# EAGLE design BT_3860 (EAGLE 6.5.0)
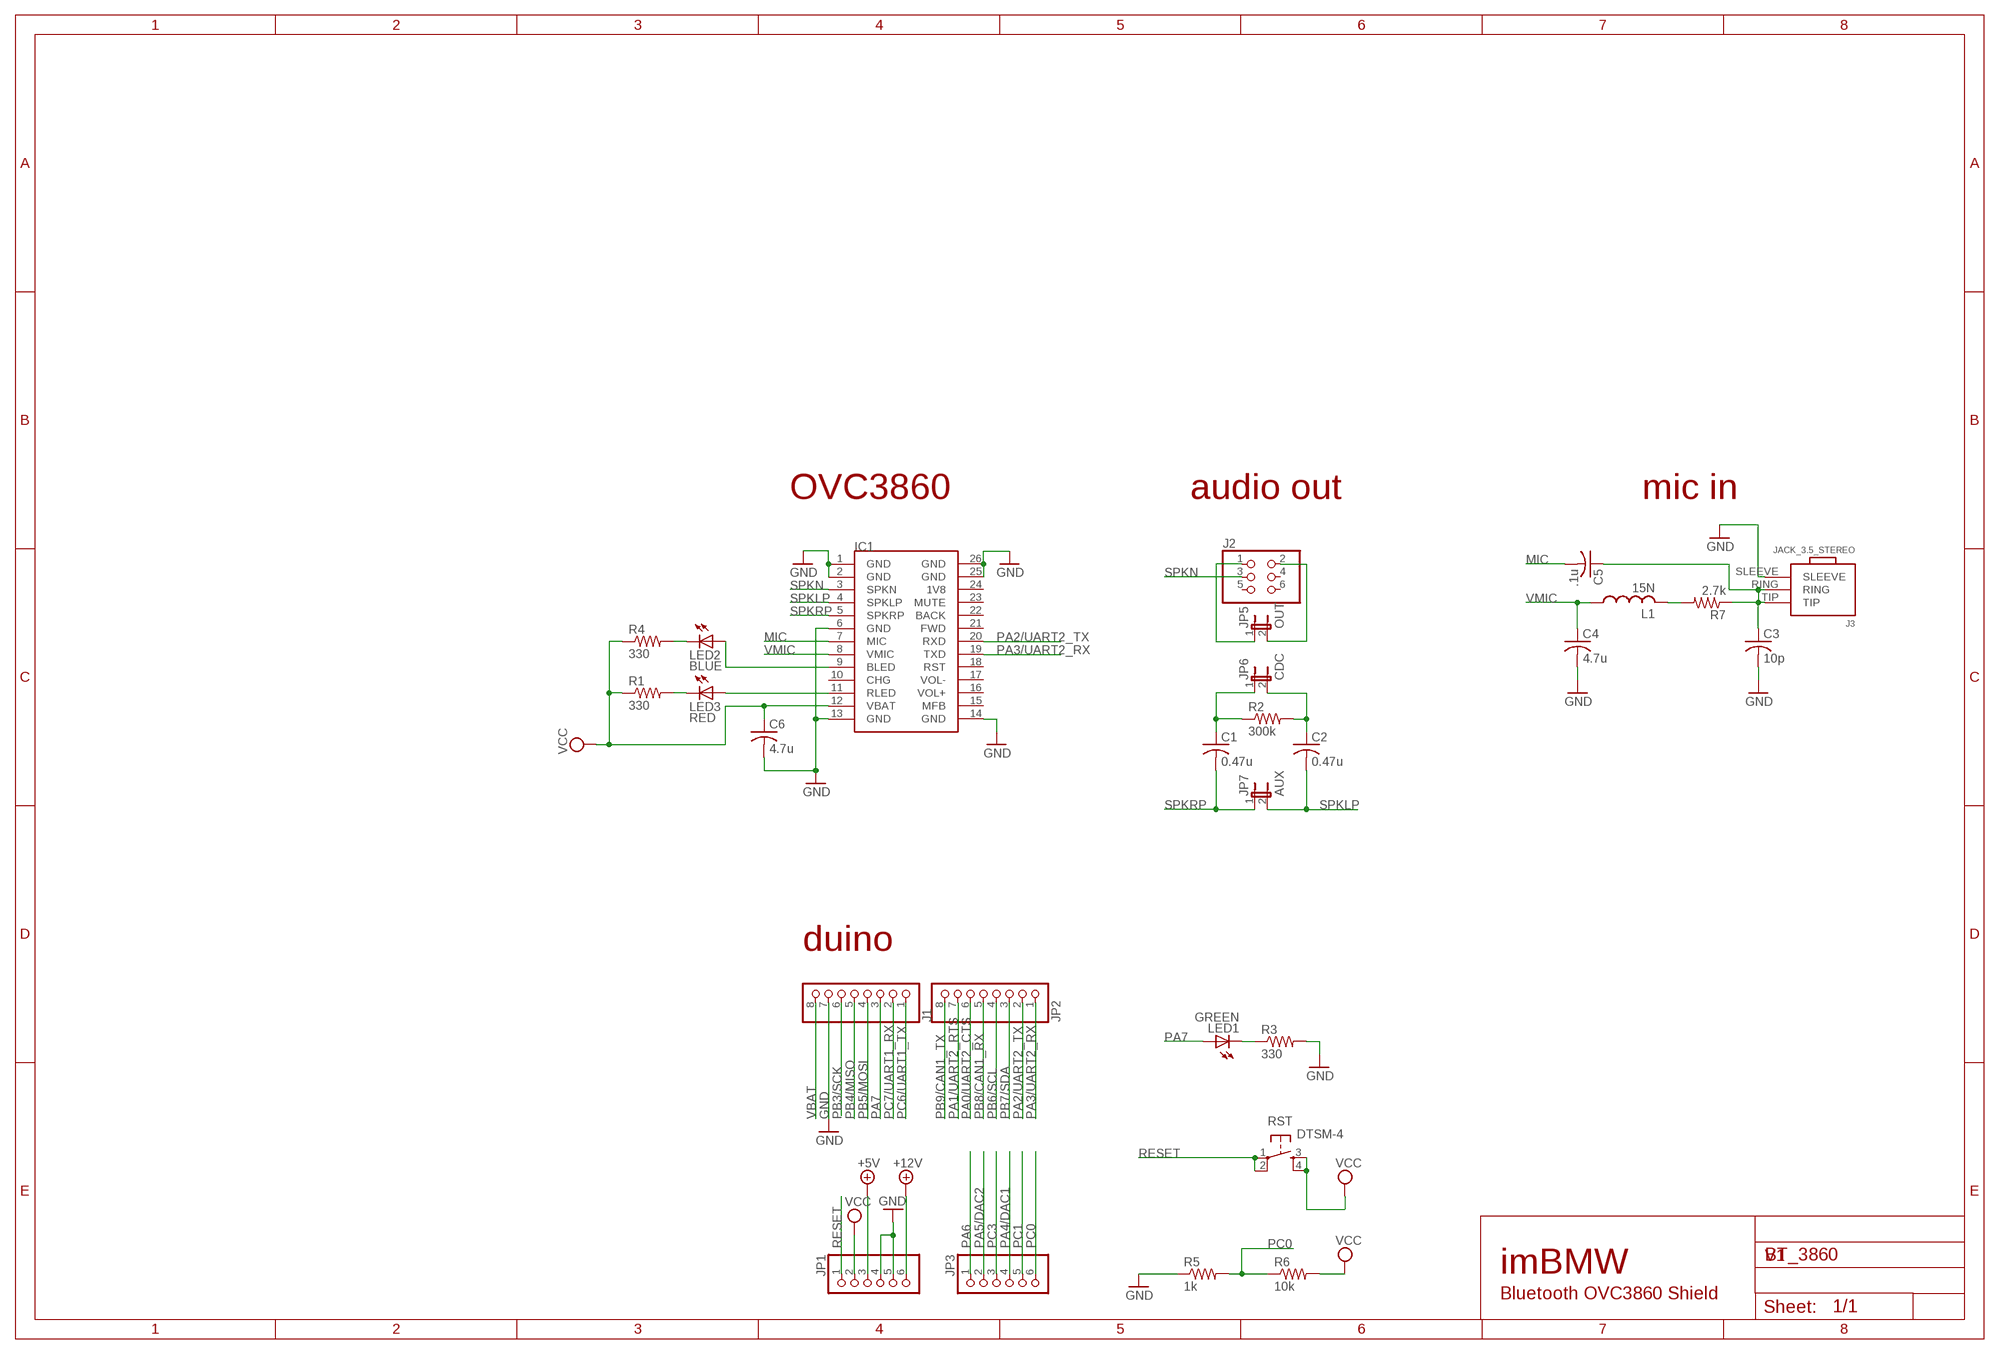
[diagram p0: schematic, sheet 1]

## Parts
C1  0.47u  C-USC0805  [C0805]
C2  0.47u  C-USC0805  [C0805]
C3  10p  C-USC0805  [C0805]
C4  4.7u  C-USC0805  [C0805]
C5  .1u  C-USC0805  [C0805]
C6  4.7u  C-USC0805  [C0805]
IC1  BLK-MD-SPK-B  [BLK-MD-SPK-B]
J1  PINHD-1X8  [1X08]
J2  PINHD-2X3  [2X03]
J3  JACK_3.5_STEREO  [JACK_3.5_STEREO]
JP1  PINHD-1X6  [1X06]
JP2  PINHD-1X8  [1X08]
JP3  PINHD-1X6  [1X06]
JP5  OUT  JP1E  [JP1]
JP6  CDC  JP1E  [JP1]
JP7  AUX  JP1E  [JP1]
L1  15N  L-USL3230M  [L3230M]
LED1  GREEN  LEDSML0603  [SML0603]
LED2  BLUE  LEDSML0603  [SML0603]
LED3  RED  LEDSML0603  [SML0603]
R1  330  R-US_R0805  [R0805]
R2  300k  R-US_R0805  [R0805]
R3  330  R-US_R0805  [R0805]
R4  330  R-US_R0805  [R0805]
R5  1k  R-US_R0805  [R0805]
R6  10k  R-US_R0805  [R0805]
R7  2.7k  R-US_R0805  [R0805]
RST  DTSM-4  [DTSM-4]

## Nets
+5V: JP1.3
+12V: JP1.6
GND: C3.2 C4.2 C6.2 IC1.1(GND) IC1.2(GND) IC1.6(GND) IC1.13(GND) IC1.14(GND) IC1.25(GND) IC1.26(GND) J1.7 J3.SLEEVE JP1.4 JP1.5 R3.2 R5.1
MIC: C5.2 IC1.7(MIC)
N$1: C2.1 JP6.2 R2.2
N$2: C1.1 JP6.1 R2.1
N$3: J2.1 JP5.1
N$4: J2.2 JP5.2
N$6: LED1.C R3.1
N$7: LED3.C R1.2
N$10: IC1.11(RLED) LED3.A
N$11: IC1.9(BLED) LED2.A
N$12: LED2.C R4.2
N$155: C3.1 C5.1 J3.RING J3.TIP R7.1
N$157: L1.2 R7.2
PA0/UART2_CTS: JP2.6
PA1/UART2_RTS: JP2.7
PA2/UART2_TX: IC1.20(RXD) JP2.2
PA3/UART2_RX: IC1.19(TXD) JP2.1
PA4/DAC1: JP3.4
PA5/DAC2: JP3.2
PA6: JP3.1
PA7: J1.3 LED1.A
PB3/SCK: J1.6
PB4/MISO: J1.5
PB5/MOSI: J1.4
PB6/SCL: JP2.4
PB7/SDA: JP2.3
PB8/CAN1_RX: JP2.5
PB9/CAN1_TX: JP2.8
PC0: JP3.6 R5.2 R6.1
PC1: JP3.5
PC3: JP3.3
PC6/UART1_TX: J1.1
PC7/UART1_RX: J1.2
RESET: JP1.1 RST.1 RST.2
SPKLP: C2.2 IC1.4(SPKLP) JP7.2
SPKN: IC1.3(SPKN) J2.3
SPKRP: C1.2 IC1.5(SPKRP) JP7.1
VBAT: J1.8
VCC: C6.1 IC1.12(VBAT) JP1.2 R1.1 R4.1 R6.2 RST.3 RST.4
VMIC: C4.1 IC1.8(VMIC) L1.1
Unconnected: IC1.10(CHG) IC1.15(MFB) IC1.16(VOL+) IC1.17(VOL-) IC1.18(RST) IC1.21(FWD) IC1.22(BACK) IC1.23(MUTE) IC1.24(1V8) J2.4 J2.5 J2.6

## Notes on the sheet
- OVC3860 | audio out | mic in
- duino
- V1
- imBMW
- Bluetooth OVC3860 Shield

## Library data of the parts
C1-C6 = rcl:C-US: CAPACITOR, American symbol
IC1 = BLK-MD-SPK-B_2:BLK-MD-SPK-B
J1 JP2 = pinhead:PINHD-1X8: PIN HEADER
J2 = pinhead:PINHD-2X3: PIN HEADER
J3 = toxs:JACK_3.5_STEREO
JP1 JP3 = pinhead:PINHD-1X6: PIN HEADER
JP5-JP7 = jumper:JP1E: JUMPER
L1 = rcl:L-US: INDUCTOR, American symbol
LED1-LED3 = led:LED: LED OSRAM: - CHIPLED LG R971, LG N971, LY N971, LG Q971, LY Q971, LO R971, LY R971 LH N974, LH R974 LS Q976, LO Q976, LY Q976 LO Q996 - Hyper CHIPLED LW Q18S LB Q993, LB Q99A, LB R99A - SideLED LS A670, LO A670, LY A670, LG A670, LP A670 LB A673, LV A673, LT A673, LW A673 LH A674 LY A675 LS A676, LA A676, LO A676, LY A676, LW A676 LS A679, LY A679, LG A679 - Hyper Micro SIDELED® LS Y876, LA Y876, LO Y876, LY Y876 LT Y87S - SmartLED LW L88C, LW L88S LB L89C, LB L89S, LG L890 LS L89K, LO L89K, LY L89K LS L896, LA L896, LO L896, LY L896 - TOPLED LS T670, LO T670, LY T670, LG T670, LP T670 LSG T670, LSP T670, LSY T670, LOP T670, LYG T670 LG T671, LOG T671, LSG T671 LB T673, LV T673, LT T673, LW T673 LH T674 LS T676, LA T676, LO T676, LY T676, LB T676, LH T676, LSB T676, LW T676 LB T67C, LV T67C, LT T67C, LS T67K, LO T67K, LY T67K, LW E67C LS E67B, LA E67B, LO E67B, LY E67B, LB E67C, LV E67C, LT E67C LW T67C LS T679, LY T679, LG T679 LS T770, LO T770, LY T770, LG T770, LP T770 LB T773, LV T773, LT T773, LW T773 LH T774 LS E675, LA E675, LY E675, LS T675 LS T776, LA T776, LO T776, LY T776, LB T776 LHGB T686 LT T68C, LB T68C - Hyper Mini TOPLED® LB M676 - Mini TOPLED Santana® LG M470 LS M47K, LO M47K, LY M47K Source: http://www.osram.convergy.de LUXEON: - LUMILED® LXK2-PW12-R00, LXK2-PW12-S00, LXK2-PW14-U00, LXK2-PW14-V00 LXK2-PM12-R00, LXK2-PM12-S00, LXK2-PM14-U00 LXK2-PE12-Q00, LXK2-PE12-R00, LXK2-PE12-S00, LXK2-PE14-T00, LXK2-PE14-U00 LXK2-PB12-K00, LXK2-PB12-L00, LXK2-PB12-M00, LXK2-PB14-N00, LXK2-PB14-P00, LXK2-PB14-Q00 LXK2-PR12-L00, LXK2-PR12-M00, LXK2-PR14-Q00, LXK2-PR14-R00 LXK2-PD12-Q00, LXK2-PD12-R00, LXK2-PD12-S00 LXK2-PH12-R00, LXK2-PH12-S00 LXK2-PL12-P00, LXK2-PL12-Q00, LXK2-PL12-R00 Source: www.luxeon.com KINGBRIGHT: KA-3528ASYC Source: www.kingbright.com
R1-R7 = rcl:R-US_: RESISTOR, American symbol
RST = switch-tact:DTSM-4

## Net classes
0 default: width 0.254 mm, drill 0.381 mm, clearance 0.203 mm
2 gnd: width 0.254 mm, drill 0.381 mm, clearance 0.203 mm
3 usbvcc: width 0.508 mm, drill 0.508 mm, clearance 2.235 mm

## Board
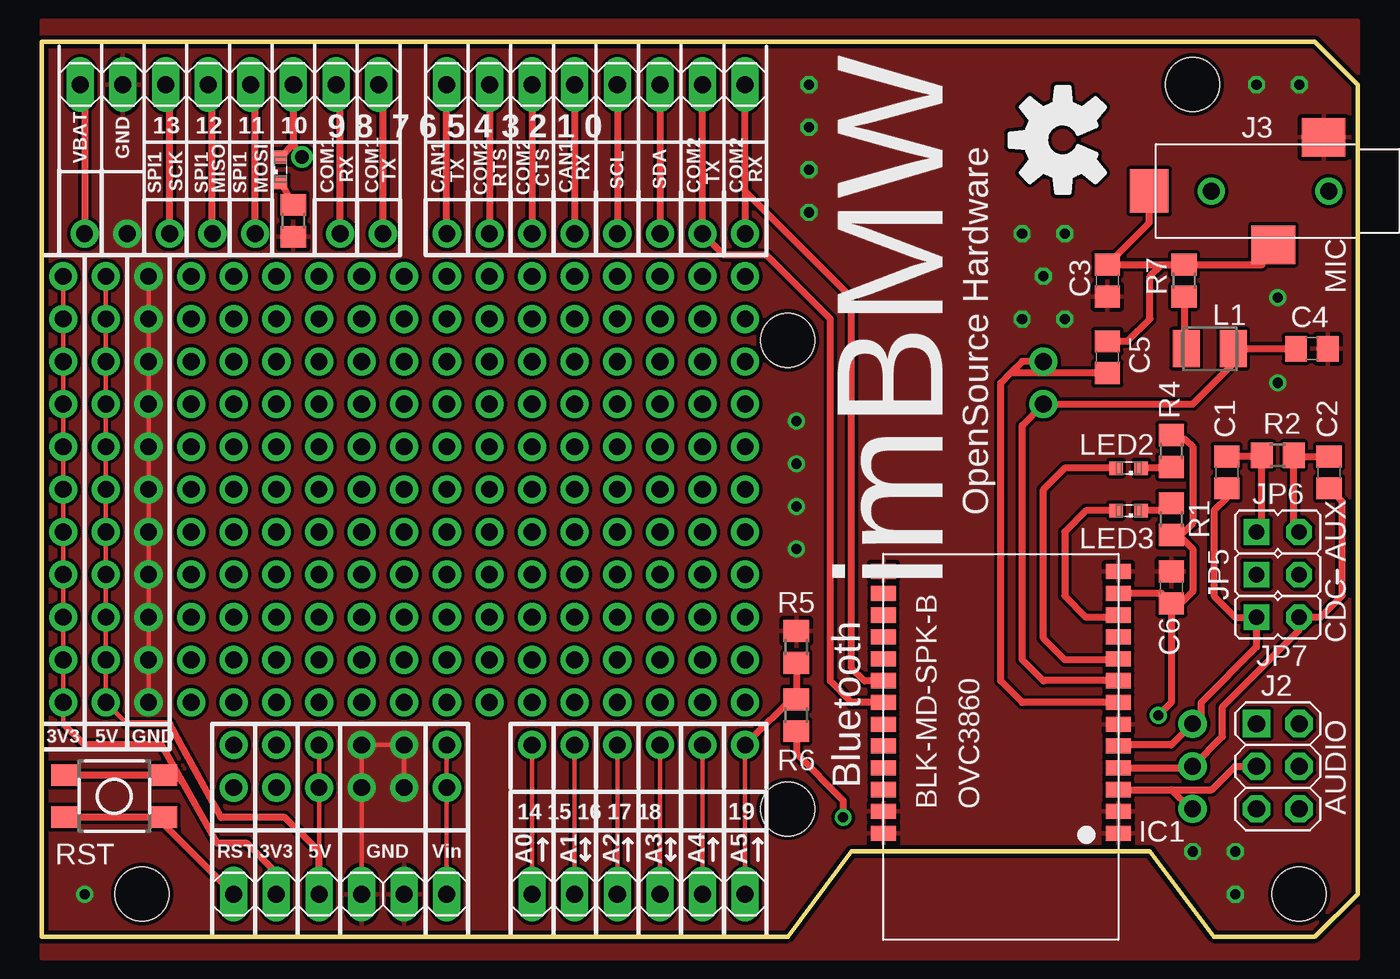
[diagram p1: board, top side]
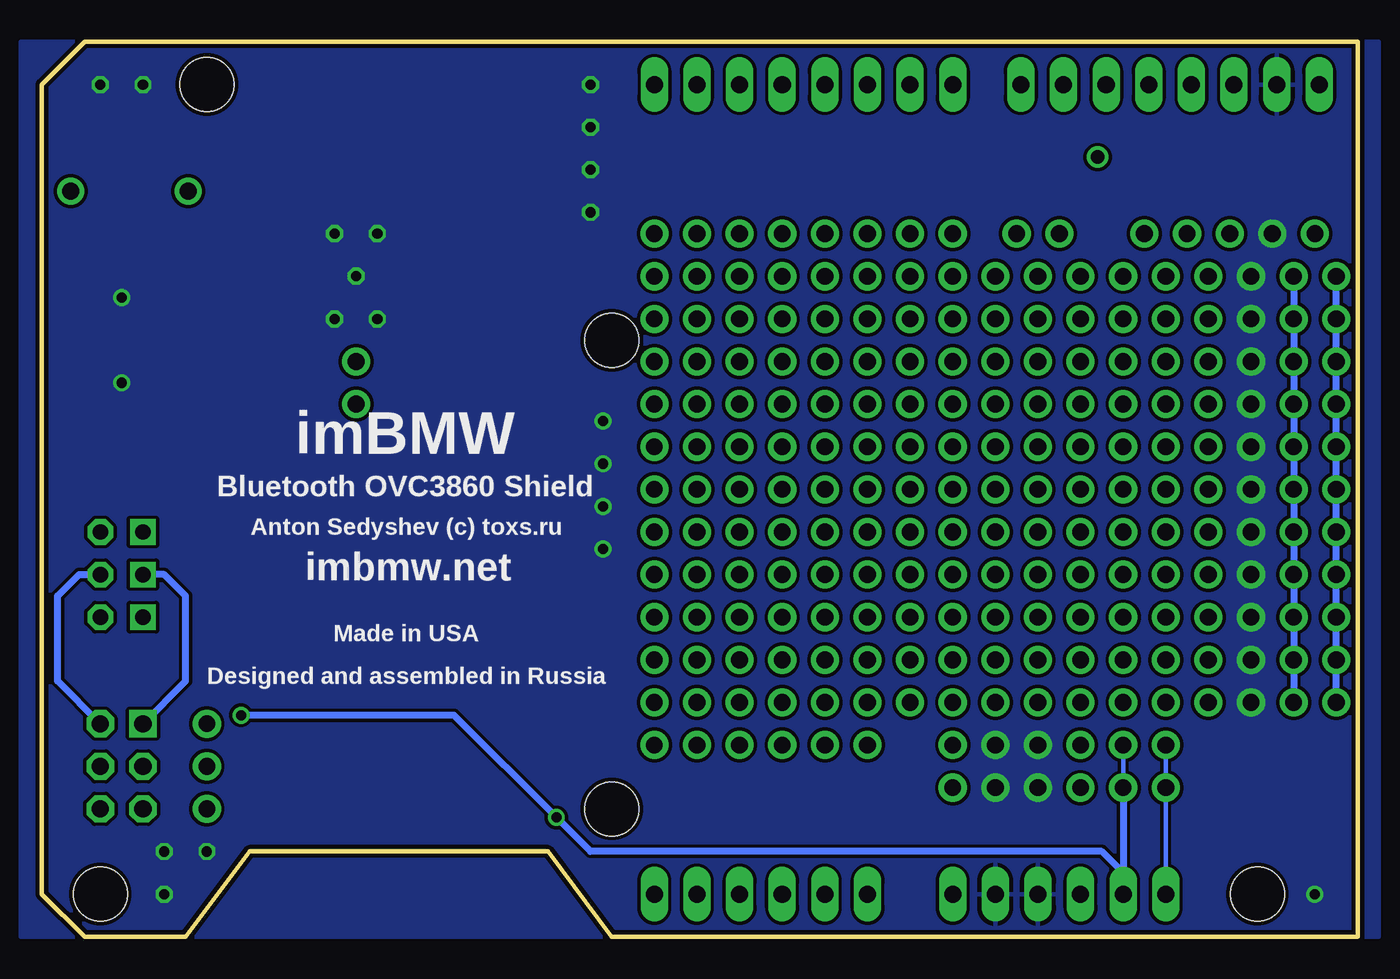
[diagram p2: board, bottom side, seen from below]

Size 78.41 x 53.34 mm. Coordinates in mm from the lower left corner, seen from the top.
Outline: 0,53.34 75.87,53.34 78.41,50.8 78.41,2.54 75.87,0 69.85,0 66.04,5.08 48.26,5.08 44.45,0 0,0 0,53.34
Copper layers (1*16): Top 0.035mm / dielectric 1.5mm / Bottom 0.035mm
Design rules "DFRobot_Eagle_Rule_v0.4": minimum track width 6mil, minimum drill 12mil, track to track 6mil, track to pad 6mil, pad to pad 6mil, via to via 6mil, smd to smd 0mil, copper to edge 10mil, drill to drill 10mil, minimum pad ring 12mil, minimum via ring 8mil, stop-mask expansion 2mil, vias tented up to drill 25mil, thermal gap 10mil
Holes 3.2 mm at 44.45,35.56 44.45,7.62 74.93,2.54 68.58,50.8 5.97,2.54

### Footprints (pad centres in the part's own frame; a part is rotated, then mirrored left to right if it is on the bottom)
C0805 = smd 1.3 x 1.5: 1 -0.95,0; 2 0.95,0
BLK-MD-SPK-B = smd 1.5 x 0.9: 1 -7,7.8; 2 -7,6.5; 3 -7,5.2; 4 -7,3.9; 5 -7,2.6; 6 -7,1.3; 7 -7,0; 8 -7,-1.3; 9 -7,-2.6; 10 -7,-3.9; 11 -7,-5.2; 12 -7,-6.5; 13 -7,-7.8; 14 7,-7.8; 15 7,-6.5; 16 7,-5.2; 17 7,-3.9; 18 7,-2.6; 19 7,-1.3; 20 7,0; 21 7,1.3; 22 7,2.6; 23 7,3.9; 24 7,5.2; 25 7,6.5; 26 7,7.8
1X08 = drill 1.016 long: 1 -8.89,0; 2 -6.35,0; 3 -3.81,0; 4 -1.27,0; 5 1.27,0; 6 3.81,0; 7 6.35,0; 8 8.89,0
2X03 = drill 1.016 square: 1 -2.54,-1.27 | drill 1.016 octagon: 2 -2.54,1.27; 3 0,-1.27; 4 0,1.27; 5 2.54,-1.27; 6 2.54,1.27
JACK_3.5_STEREO = drill 1: P$4 -2.7,0; P$5 4.3,0 | smd 2.6 x 2.3: RING 1,-3.2; SLEEVE 4,3.2 | smd 2.3 x 2.6: TIP -6.4,0
1X06 = drill 1.016 long: 1 -6.35,0; 2 -3.81,0; 3 -1.27,0; 4 1.27,0; 5 3.81,0; 6 6.35,0
JP1 = drill 0.914 square: 1 0,-1.27 | drill 0.914 octagon: 2 0,1.27
L3230M = smd 1.6 x 2.2: 1 -1.4,0; 2 1.4,0
SML0603 = smd 0.8 x 0.8: A 0.75,0; C -0.75,0
R0805 = smd 1.3 x 1.5: 1 -0.95,0; 2 0.95,0
DTSM-4 = smd 1.55 x 1.3: 1 -2.975,1.25; 2 2.975,1.25; 3 -2.975,-1.25; 4 2.975,-1.25

### Placement (x,y rotation side)
C1  70.61,27.69 270 top
C2  76.71,27.69 270 top
C3  63.5,39.12 270 top
C4  75.69,35.05 0 top
C5  63.5,34.54 270 top
C6  67.31,20.83 90 top
IC1  57.15,13.97 180 top
J1  11.18,50.8 180 top
J2  73.66,10.16 270 top
J3  72.39,44.45 0 top
JP1  17.78,2.54 0 top
JP2  33.02,50.8 180 top
JP3  35.56,2.54 0 top
JP5  73.66,21.59 270 top
JP6  73.66,24.13 270 top
JP7  73.66,19.05 270 top
L1  69.6,35.05 180 top
LED1  14.22,45.72 90 top
LED2  64.77,27.94 180 top
LED3  64.77,25.4 180 top
R1  67.31,24.89 90 top
R2  73.66,28.7 0 top
R3  14.99,42.67 270 top
R4  67.31,28.96 270 top
R5  44.96,17.27 270 top
R6  44.96,13.21 270 top
R7  68.07,39.12 270 top
RST  4.32,8.38 180 top

### Tracks (layer width: path | path; a pad name or v marks a point on that pad's centre or on a via)
+5V  (via drill 1 pad 1.68)
  Top 0.254: 5.08,12.7 v3.81,13.97 v3.81,16.51 v3.81,19.05 v3.81,21.59 v3.81,24.13 v3.81,26.67 v3.81,29.21 v3.81,31.75 v3.81,34.29 v3.81,36.83 v3.81,39.37 | 16.51,5.08 v16.51,8.89 v16.51,11.43
  Top 0.406: JP1.3 16.51,5.08 14.48,7.11 10.67,7.11 7.62,12.7 5.08,12.7
  Bottom 0.406: v3.81,39.37 v3.81,36.83 v3.81,34.29 v3.81,31.75 v3.81,29.21 v3.81,26.67 v3.81,24.13 v3.81,21.59 v3.81,19.05 v3.81,16.51 v3.81,13.97
+12V  (via drill 1 pad 1.68)
  Top 0.254: JP1.6 v24.13,8.89 v24.13,11.43
GND  (via drill 0.6, 1 pad 1.68)
  Top 0.254: v6.35,39.37 v6.35,36.83 v6.35,34.29 v6.35,31.75 v6.35,29.21 v6.35,26.67 v6.35,24.13 v6.35,21.59 v6.35,19.05 v6.35,16.51 v6.35,13.97 | JP1.4 v19.05,8.89 v19.05,11.43 v21.59,11.43 v21.59,8.89
  Top 0.406: C6.2
  other vias: 5.08,41.91 45.72,50.8 45.72,48.26 45.72,45.72 45.72,43.18 58.42,41.91 60.96,41.91 59.69,39.37 58.42,36.83 60.96,36.83 72.39,50.8 74.93,50.8 71.12,2.54 71.12,5.08 68.58,5.08 2.54,2.54 44.96,30.73 44.96,28.19 44.96,25.65 44.96,23.11 73.66,38.1 73.66,33.02
  pour Top (rank 6): 0,54.61 0,-1.27 78.41,-1.27 78.41,54.61
  pour Bottom (rank 2): -1.27,53.34 -1.27,0 79.68,0 79.68,53.34
MIC  (via drill 1 pad 1.68)
  Top 0.406: IC1.7 58.42,13.97 57.15,15.24 57.15,33.02 57.72,33.59 | C5.2 57.72,33.59 | v59.69,34.29 58.42,34.29 57.72,33.59
N$1
  Top 0.406: C2.1 74.68,28.64 R2.2 74.61,24.45 JP6.2
N$2
  Top 0.406: JP6.1 72.71,24.45 R2.1 72.64,28.64 C1.1
N$3
  Bottom 0.406: J2.1 69.85,15.24 69.85,20.32 71.12,21.59 JP5.1
N$4
  Bottom 0.406: J2.2 77.47,15.24 77.47,20.32 76.2,21.59 JP5.2
N$5
  Top 0.254: 62.85,48.33 arc10 62.68,48.66 63.34,49.45 62.79,50 61.99,49.35 arc19 61.32,49.62 61.22,50.65 60.45,50.65 60.34,49.62 arc19 59.68,49.35 58.88,50 58.33,49.45 58.98,48.66 arc19 58.71,47.99 57.68,47.88 57.68,47.11 58.71,47.01 arc19 58.98,46.34 58.33,45.54 58.88,45 59.68,45.65 arc19 60.34,45.37 60.45,44.35 61.22,44.35 61.32,45.37 arc19 61.99,45.65 62.79,45 63.34,45.54 62.68,46.34 arc10 62.85,46.66 61.75,47.12 arc-68 60.83,46.51 arc-248 61.75,47.88 62.85,48.33
N$6
  Top 0.406: LED1.C R3.1
N$7
  Top 0.406: R1.2 66.87,25.4 LED3.C
N$9  (via drill 1 pad 1.68)
  other vias: 39.37,34.29
N$10
  Top 0.406: LED3.A 62.23,25.4 60.96,24.13 60.96,20.32 62.23,19.05 64.03,19.05 IC1.11
N$11
  Top 0.406: IC1.9 64.09,16.51 60.96,16.51 59.69,17.78 59.69,26.67 60.96,27.94 LED2.A
N$12
  Top 0.406: R4.2 67.12,27.94 LED2.C
N$13  (via drill 1 pad 1.68)
  other vias: 39.37,36.83
N$14  (via drill 1 pad 1.68)
  other vias: 39.37,39.37
N$15  (via drill 1 pad 1.68)
  other vias: 39.37,31.75
N$16  (via drill 1 pad 1.68)
  other vias: 39.37,13.97
N$17  (via drill 1 pad 1.68)
  other vias: 39.37,16.51
N$18  (via drill 1 pad 1.68)
  other vias: 39.37,19.05
N$19  (via drill 1 pad 1.68)
  other vias: 39.37,21.59
N$20  (via drill 1 pad 1.68)
  other vias: 39.37,24.13
N$21  (via drill 1 pad 1.68)
  other vias: 39.37,26.67
N$22  (via drill 1 pad 1.68)
  other vias: 39.37,29.21
N$23  (via drill 1 pad 1.68)
  other vias: 36.83,34.29
N$24  (via drill 1 pad 1.68)
  other vias: 36.83,36.83
N$25  (via drill 1 pad 1.68)
  other vias: 36.83,39.37
N$26  (via drill 1 pad 1.68)
  other vias: 36.83,31.75
N$27  (via drill 1 pad 1.68)
  other vias: 36.83,13.97
N$28  (via drill 1 pad 1.68)
  other vias: 36.83,16.51
N$29  (via drill 1 pad 1.68)
  other vias: 36.83,19.05
N$30  (via drill 1 pad 1.68)
  other vias: 36.83,21.59
N$31  (via drill 1 pad 1.68)
  other vias: 36.83,24.13
N$32  (via drill 1 pad 1.68)
  other vias: 36.83,26.67
N$33  (via drill 1 pad 1.68)
  other vias: 36.83,29.21
N$34  (via drill 1 pad 1.68)
  other vias: 34.29,34.29
N$35  (via drill 1 pad 1.68)
  other vias: 34.29,36.83
N$36  (via drill 1 pad 1.68)
  other vias: 34.29,39.37
N$37  (via drill 1 pad 1.68)
  other vias: 34.29,31.75
N$38  (via drill 1 pad 1.68)
  other vias: 34.29,13.97
N$39  (via drill 1 pad 1.68)
  other vias: 34.29,16.51
N$40  (via drill 1 pad 1.68)
  other vias: 34.29,19.05
N$41  (via drill 1 pad 1.68)
  other vias: 34.29,21.59
N$42  (via drill 1 pad 1.68)
  other vias: 34.29,24.13
N$43  (via drill 1 pad 1.68)
  other vias: 34.29,26.67
N$44  (via drill 1 pad 1.68)
  other vias: 34.29,29.21
N$45  (via drill 1 pad 1.68)
  other vias: 31.75,34.29
N$46  (via drill 1 pad 1.68)
  other vias: 31.75,36.83
N$47  (via drill 1 pad 1.68)
  other vias: 31.75,39.37
N$48  (via drill 1 pad 1.68)
  other vias: 31.75,31.75
N$49  (via drill 1 pad 1.68)
  other vias: 31.75,13.97
N$50  (via drill 1 pad 1.68)
  other vias: 31.75,16.51
N$51  (via drill 1 pad 1.68)
  other vias: 31.75,19.05
N$52  (via drill 1 pad 1.68)
  other vias: 31.75,21.59
N$53  (via drill 1 pad 1.68)
  other vias: 31.75,24.13
N$54  (via drill 1 pad 1.68)
  other vias: 31.75,26.67
N$55  (via drill 1 pad 1.68)
  other vias: 31.75,29.21
N$56  (via drill 1 pad 1.68)
  other vias: 29.21,34.29
N$57  (via drill 1 pad 1.68)
  other vias: 29.21,36.83
N$58  (via drill 1 pad 1.68)
  other vias: 29.21,39.37
N$59  (via drill 1 pad 1.68)
  other vias: 29.21,31.75
N$60  (via drill 1 pad 1.68)
  other vias: 29.21,13.97
N$61  (via drill 1 pad 1.68)
  other vias: 29.21,16.51
N$62  (via drill 1 pad 1.68)
  other vias: 29.21,19.05
N$63  (via drill 1 pad 1.68)
  other vias: 29.21,21.59
N$64  (via drill 1 pad 1.68)
  other vias: 29.21,24.13
N$65  (via drill 1 pad 1.68)
  other vias: 29.21,26.67
N$66  (via drill 1 pad 1.68)
  other vias: 29.21,29.21
N$67  (via drill 1 pad 1.68)
  other vias: 26.67,34.29
N$68  (via drill 1 pad 1.68)
  other vias: 26.67,36.83
N$69  (via drill 1 pad 1.68)
  other vias: 26.67,39.37
N$70  (via drill 1 pad 1.68)
  other vias: 26.67,31.75
N$71  (via drill 1 pad 1.68)
  other vias: 26.67,13.97
N$72  (via drill 1 pad 1.68)
  other vias: 26.67,16.51
N$73  (via drill 1 pad 1.68)
  other vias: 26.67,19.05
N$74  (via drill 1 pad 1.68)
  other vias: 26.67,21.59
N$75  (via drill 1 pad 1.68)
  other vias: 26.67,24.13
N$76  (via drill 1 pad 1.68)
  other vias: 26.67,26.67
N$77  (via drill 1 pad 1.68)
  other vias: 26.67,29.21
N$78  (via drill 1 pad 1.68)
  other vias: 24.13,34.29
N$79  (via drill 1 pad 1.68)
  other vias: 24.13,36.83
N$80  (via drill 1 pad 1.68)
  other vias: 24.13,39.37
N$81  (via drill 1 pad 1.68)
  other vias: 24.13,31.75
N$82  (via drill 1 pad 1.68)
  other vias: 24.13,13.97
N$83  (via drill 1 pad 1.68)
  other vias: 24.13,16.51
N$84  (via drill 1 pad 1.68)
  other vias: 24.13,19.05
N$85  (via drill 1 pad 1.68)
  other vias: 24.13,21.59
N$86  (via drill 1 pad 1.68)
  other vias: 24.13,24.13
N$87  (via drill 1 pad 1.68)
  other vias: 24.13,26.67
N$88  (via drill 1 pad 1.68)
  other vias: 24.13,29.21
N$89  (via drill 1 pad 1.68)
  other vias: 21.59,34.29
N$90  (via drill 1 pad 1.68)
  other vias: 21.59,36.83
N$91  (via drill 1 pad 1.68)
  other vias: 21.59,39.37
N$92  (via drill 1 pad 1.68)
  other vias: 21.59,31.75
N$93  (via drill 1 pad 1.68)
  other vias: 21.59,13.97
N$94  (via drill 1 pad 1.68)
  other vias: 21.59,16.51
N$95  (via drill 1 pad 1.68)
  other vias: 21.59,19.05
N$96  (via drill 1 pad 1.68)
  other vias: 21.59,21.59
N$97  (via drill 1 pad 1.68)
  other vias: 21.59,24.13
N$98  (via drill 1 pad 1.68)
  other vias: 21.59,26.67
N$99  (via drill 1 pad 1.68)
  other vias: 21.59,29.21
N$100  (via drill 1 pad 1.68)
  other vias: 19.05,34.29
N$101  (via drill 1 pad 1.68)
  other vias: 19.05,36.83
N$102  (via drill 1 pad 1.68)
  other vias: 19.05,39.37
N$103  (via drill 1 pad 1.68)
  other vias: 19.05,31.75
N$104  (via drill 1 pad 1.68)
  other vias: 19.05,13.97
N$105  (via drill 1 pad 1.68)
  other vias: 19.05,16.51
N$106  (via drill 1 pad 1.68)
  other vias: 19.05,19.05
N$107  (via drill 1 pad 1.68)
  other vias: 19.05,21.59
N$108  (via drill 1 pad 1.68)
  other vias: 19.05,24.13
N$109  (via drill 1 pad 1.68)
  other vias: 19.05,26.67
N$110  (via drill 1 pad 1.68)
  other vias: 19.05,29.21
N$111  (via drill 1 pad 1.68)
  other vias: 16.51,34.29
N$112  (via drill 1 pad 1.68)
  other vias: 16.51,36.83
N$113  (via drill 1 pad 1.68)
  other vias: 16.51,39.37
N$114  (via drill 1 pad 1.68)
  other vias: 16.51,31.75
N$115  (via drill 1 pad 1.68)
  other vias: 16.51,13.97
N$116  (via drill 1 pad 1.68)
  other vias: 16.51,16.51
N$117  (via drill 1 pad 1.68)
  other vias: 16.51,19.05
N$118  (via drill 1 pad 1.68)
  other vias: 16.51,21.59
N$119  (via drill 1 pad 1.68)
  other vias: 16.51,24.13
N$120  (via drill 1 pad 1.68)
  other vias: 16.51,26.67
N$121  (via drill 1 pad 1.68)
  other vias: 16.51,29.21
N$122  (via drill 1 pad 1.68)
  other vias: 13.97,34.29
N$123  (via drill 1 pad 1.68)
  other vias: 13.97,36.83
N$124  (via drill 1 pad 1.68)
  other vias: 13.97,39.37
N$125  (via drill 1 pad 1.68)
  other vias: 13.97,31.75
N$126  (via drill 1 pad 1.68)
  other vias: 13.97,13.97
N$127  (via drill 1 pad 1.68)
  other vias: 13.97,16.51
N$128  (via drill 1 pad 1.68)
  other vias: 13.97,19.05
N$129  (via drill 1 pad 1.68)
  other vias: 13.97,21.59
N$130  (via drill 1 pad 1.68)
  other vias: 13.97,24.13
N$131  (via drill 1 pad 1.68)
  other vias: 13.97,26.67
N$132  (via drill 1 pad 1.68)
  other vias: 13.97,29.21
N$133  (via drill 1 pad 1.68)
  other vias: 11.43,34.29
N$134  (via drill 1 pad 1.68)
  other vias: 11.43,36.83
N$135  (via drill 1 pad 1.68)
  other vias: 11.43,39.37
N$136  (via drill 1 pad 1.68)
  other vias: 11.43,31.75
N$137  (via drill 1 pad 1.68)
  other vias: 11.43,13.97
N$138  (via drill 1 pad 1.68)
  other vias: 11.43,16.51
N$139  (via drill 1 pad 1.68)
  other vias: 11.43,19.05
N$140  (via drill 1 pad 1.68)
  other vias: 11.43,21.59
N$141  (via drill 1 pad 1.68)
  other vias: 11.43,24.13
N$142  (via drill 1 pad 1.68)
  other vias: 11.43,26.67
N$143  (via drill 1 pad 1.68)
  other vias: 11.43,29.21
N$144  (via drill 1 pad 1.68)
  other vias: 8.89,34.29
N$145  (via drill 1 pad 1.68)
  other vias: 8.89,36.83
N$146  (via drill 1 pad 1.68)
  other vias: 8.89,39.37
N$147  (via drill 1 pad 1.68)
  other vias: 8.89,31.75
N$148  (via drill 1 pad 1.68)
  other vias: 8.89,13.97
N$149  (via drill 1 pad 1.68)
  other vias: 8.89,16.51
N$150  (via drill 1 pad 1.68)
  other vias: 8.89,19.05
N$151  (via drill 1 pad 1.68)
  other vias: 8.89,21.59
N$152  (via drill 1 pad 1.68)
  other vias: 8.89,24.13
N$153  (via drill 1 pad 1.68)
  other vias: 8.89,26.67
N$154  (via drill 1 pad 1.68)
  other vias: 8.89,29.21
N$155
  Top 0.406: R7.1 C3.1 66,42.56 J3.TIP | R7.1 72.71,40.07 J3.RING | C5.1 64.7,35.49 66.04,36.83 66.04,39.37 66.74,40.07 R7.1
N$156
  pour Top (isolate 2.54): 10.16,38.1 40.64,38.1 40.64,15.24 10.16,15.24
N$157
  Top 0.406: R7.2 68.07,35.18 L1.2
N$158
  pour Bottom (isolate 2.54): 10.16,38.1 40.64,38.1 40.64,15.24 10.16,15.24
N$191  (via drill 1 pad 1.68)
  other vias: 41.91,34.29
N$192  (via drill 1 pad 1.68)
  other vias: 41.91,36.83
N$193  (via drill 1 pad 1.68)
  other vias: 41.91,39.37
N$201  (via drill 1 pad 1.68)
  other vias: 41.91,31.75
N$202  (via drill 1 pad 1.68)
  other vias: 41.91,13.97
N$203  (via drill 1 pad 1.68)
  other vias: 41.91,16.51
N$204  (via drill 1 pad 1.68)
  other vias: 41.91,19.05
N$205  (via drill 1 pad 1.68)
  other vias: 41.91,21.59
N$206  (via drill 1 pad 1.68)
  other vias: 41.91,24.13
N$207  (via drill 1 pad 1.68)
  other vias: 41.91,26.67
N$208  (via drill 1 pad 1.68)
  other vias: 41.91,29.21
PA0/UART2_CTS  (via drill 1 pad 1.68)
  Top 0.406: JP2.6 v29.21,41.91
PA1/UART2_RTS  (via drill 1 pad 1.68)
  Top 0.406: JP2.7 v26.67,41.91
PA2/UART2_TX  (via drill 1 pad 1.68)
  Top 0.406: IC1.20 48.26,13.97 46.99,15.24 46.99,36.83 43.18,40.64 40.64,40.64 v39.37,41.91 JP2.2
PA3/UART2_RX  (via drill 1 pad 1.68)
  Top 0.406: IC1.19 50.12,15.24 49.02,15.24 48.26,16 48.26,38.1 41.91,44.45 | 41.91,44.45 JP2.1 | 41.91,44.45 v41.91,41.91
PA4/DAC1  (via drill 1 pad 1.68)
  Top 0.254: JP3.4 v36.83,11.43
PA5/DAC2  (via drill 1 pad 1.68)
  Top 0.254: JP3.2 v31.75,11.43
PA6  (via drill 1 pad 1.68)
  Top 0.254: JP3.1 v29.21,11.43
PA7  (via drill 0.8 pad 1.27)
  Top 0.406: J1.3 14.99,47.24 | 14.99,47.24 14.99,47.23 LED1.A | 14.99,47.24 v15.49,46.48
PB3/SCK  (via drill 1 pad 1.68)
  Top 0.406: v7.62,41.91 7.62,50.55 J1.6
PB4/MISO  (via drill 1 pad 1.68)
  Top 0.406: v10.16,41.91 10.16,50.55 J1.5
PB5/MOSI  (via drill 1 pad 1.68)
  Top 0.406: v12.7,41.91 12.7,50.55 J1.4
PB6/SCL  (via drill 1 pad 1.68)
  Top 0.406: JP2.4 v34.29,41.91
PB7/SDA  (via drill 1 pad 1.68)
  Top 0.406: JP2.3 v36.83,41.91
PB8/CAN1_RX  (via drill 1 pad 1.68)
  Top 0.406: JP2.5 v31.75,41.91
PB9/CAN1_TX  (via drill 1 pad 1.68)
  Top 0.406: v24.13,41.91 JP2.8
PC0  (via drill 1 pad 1.68)
  Top 0.254: JP3.6 v41.91,11.43
  Top 0.406: 44.96,14.48 R6.1 | R5.2 44.96,14.48 | 44.96,14.48 v41.91,11.43
PC1  (via drill 1 pad 1.68)
  Top 0.254: JP3.5 v39.37,11.43
PC3  (via drill 1 pad 1.68)
  Top 0.254: JP3.3 v34.29,11.43
PC6/UART1_TX  (via drill 1 pad 1.68)
  Top 0.406: v20.32,41.91 20.32,50.55 J1.1
PC7/UART1_RX  (via drill 1 pad 1.68)
  Top 0.406: v17.78,41.91 17.78,50.55 J1.2
RESET  (via drill 1 pad 1.68)
  Top 0.406: RST.2 RST.1 7.29,6.68 JP1.1
  Bottom 0.254: JP1.1 v11.43,8.89 v11.43,11.43
SPKLP  (via drill 1 pad 1.68)
  Top 0.406: C2.2 77.47,25.97 77.47,20.32 76.2,19.05 JP7.2 74.93,18.29 70.36,13.72 70.36,11.94 v68.58,10.16 68.49,10.07 IC1.4
SPKN  (via drill 1 pad 1.68)
  Top 0.406: IC1.3 67.31,8.77 | 67.31,8.77 69.73,8.77 71.12,10.16 J2.3 | v68.58,7.62 68.46,7.62 67.31,8.77
SPKRP  (via drill 1 pad 1.68)
  Top 0.406: IC1.5 64.21,11.43 67.31,11.43 v68.58,12.7 69.09,13.21 69.09,13.97 72.39,17.27 JP7.1 71.12,19.05 69.85,20.32 69.85,25.4 70.61,26.16 C1.2
VBAT  (via drill 1 pad 1.68)
  Top 0.406: J1.8 2.54,50.55 v2.54,41.91
VCC  (via drill 0.6, 1 pad 1.68)
  Top 0.254: 1.27,12.7 v1.27,13.97 v1.27,16.51 v1.27,19.05 v1.27,21.59 v1.27,24.13 v1.27,26.67 v1.27,29.21 v1.27,31.75 v1.27,34.29 v1.27,36.83 v1.27,39.37
  Top 0.406: RST.4 RST.3 7.72,9.89 8.32,9.29 | 1.27,12.7 2.54,11.43 7.11,11.43 8.32,9.29 | R6.2 44.96,10.92 47.75,8.13 v47.75,7.11 | v66.55,13.21 67.31,13.97 C6.1 | 8.32,9.29 10.41,5.59 12.19,5.59 13.97,3.81 JP1.2 | C6.1 66.72,20.47 IC1.12 | R4.1 68.14,29.65 68.58,29.21 68.58,24.64 67.88,23.94 R1.1 67.75,23.94 68.58,23.11 68.58,20.57 67.82,19.81 67.38,19.81 C6.1
  Bottom 0.254: v13.97,8.89 v13.97,11.43
  Bottom 0.406: v1.27,13.97 v1.27,16.51 v1.27,19.05 v1.27,21.59 v1.27,24.13 v1.27,26.67 v1.27,29.21 v1.27,31.75 v1.27,34.29 v1.27,36.83 v1.27,39.37 | v66.55,13.21 53.85,13.21 v47.75,7.11 45.72,5.08 15.24,5.08 13.97,3.81 | JP1.2 13.97,3.81 | v13.97,8.89 13.97,3.81
VMIC  (via drill 1 pad 1.68)
  Top 0.406: IC1.8 59.69,15.27 59.69,15.24 58.42,16.51 58.42,30.48 v59.69,31.75 68.58,31.75 71.12,34.29 71.12,34.93 L1.1 C4.1

### Text on the board
tPlace: imBMW | 13 | 12 | 11 | 10 | 9 8 7 6 5 4 3 2 1 0 | VBAT | GND | RX | TX | TX | RTS | CTS | RX | SCL | SDA | TX | RX | SPI1 | SCK | SPI1 | MISO | SPI1 | MOSI | COM1 | COM1 | CAN1 | COM2 | COM2 | CAN1 | COM2 | COM2 | MIC | OpenSource Hardware | AUX | CDC | AUDIO | 3V3 | 5V | GND | Bluetooth | BLK-MD-SPK-B | OVC3860 | 14 15 16 17 18 | 19 | RST | 3V3 | 5V | GND | Vin | A0 | A1 | A2 | A3 | A4 | A5
bPlace: imBMW | Bluetooth OVC3860 Shield | Anton Sedyshev (c) toxs.ru | imbmw.net | Made in USA | Designed and assembled in Russia